# Altium project DS137-1.0-C二氧化硫传感器.PrjPcb
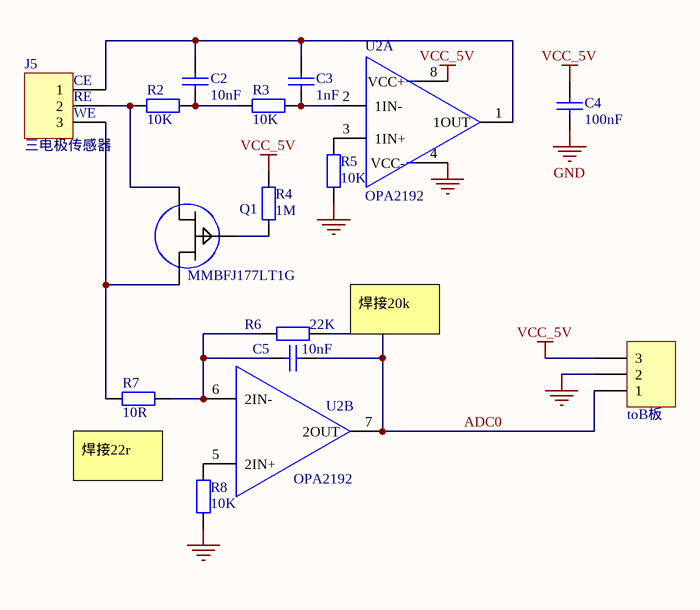
[diagram p0: DS137-1.0-C二氧化硫传感器.SchDoc]
2 sheets, 33 parts. Net scope: global (net labels, ports and power ports of the same name join across sheets).
Board file: DS137-1.0-C二氧化硫传感器.PcbDoc
Sheets:
  DS137-1.0-C二氧化硫传感器.SchDoc
  DS137-1.0-B二氧化硫传感器.SchDoc

## Sheet DS137-1.0-C二氧化硫传感器.SchDoc
size A4; SheetNumber: 1; SheetTotal: 2

### Parts
(Parts that share a designator on the sheet are numbered #1, #2 ... from top to bottom, then left to right.)
?  value toB板  [XH2.54-3P]  (hidden comment: SL000000028)
C2#1  value 10nF  [0603CAP]  (hidden comment: SMDCAP00010)
C3#1  value 1nF  [0603CAP]  (hidden comment: SMDCAP00008)
C4#1  value 100nF  [0603CAP]  (hidden comment: SMDCAP00013)
C5#1  value 10nF  [0603CAP]  (hidden comment: SMDCAP00010)
J5#1  value 三电极传感器  [3_Electrode]  (hidden comment: SL000000042)
Q1  MMBFJ177LT1G  [SOT23]
R2  value 10K  [0603RES]  (hidden comment: SMDRES00056)
R3  value 10K  [0603RES]  (hidden comment: SMDRES00056)
R4  value 1M  [0603RES]  (hidden comment: SMDRES00085)
R5  value 10K  [0603RES]  (hidden comment: SMDRES00056)
R6  value 22K  [0603RES]  (hidden comment: SMDRES00108)
R7  value 10R  [0603RES]  (hidden comment: SMDRES00005)
R8  value 10K  [0603RES]  (hidden comment: SMDRES00056)
U2#1  OPA2192  [SO-8]  (parts A,B of 2)

### Nets
GND: ?.2 C4#1.1 R5.1 R8.1 U2#1.4(VCC-)
VCC_5V: ?.3 C4#1.2 R4.2 U2#1.8(VCC+)
ADC0: ?.1 C5#1.1 R6.2 U2#1.7(2OUT)
NetC2#1_1: C2#1.1 R2.2 R3.1
NetC2#1_2: C2#1.2 C3#1.2 J5#1.1 U2#1.1(1OUT)
NetC3#1_1: C3#1.1 R3.2 U2#1.2(1IN-)
NetC5#1_2: C5#1.2 R6.1 R7.2 U2#1.6(2IN-)
NetJ5#1_2: J5#1.2 Q1.1(D) R2.1
NetJ5#1_3: J5#1.3 Q1.2(S) R7.1
NetQ1_3: Q1.3(G) R4.1
NetR5_2: R5.2 U2#1.3(1IN+)
NetR8_2: R8.2 U2#1.5(2IN+)

### Notes on the sheet
- (near J5#1) CE
- (near J5#1) RE
- (near J5#1) WE
- 焊接20k
- 焊接22r

### Library data of the parts
? = XH2.54mm-3A 直针座: 3P直针座
C2#1 C5#1 = MLCC 10nF 50V ±10％ 0603: 贴片电容
C3#1 = MLCC 1nF 50V ±10％ 0603: 贴片电容
C4#1 = MLCC 100nF 50V ±10％ 0603: 贴片电容
J5#1 = DIP3 单排直针 间距2.54mm 针长11mm 铜: 单排直针
Q1 = J177: P沟道JFET 结型场效应管(JFET) 适用于模拟开关和斩波器应用。
R2 R3 R5 R8 = Chip 10K 1/16W ±1％ 0603: 贴片电阻
R4 = Chip 1M 1/16W ±1％ 0603: 贴片电阻
R6 = Chip 22K 1/16W ±1％ 0603: 贴片电阻
R7 = Chip 10R 1/16W ±1％ 0603: 贴片电阻
U2#1 = TL062C

## Sheet DS137-1.0-B二氧化硫传感器.SchDoc
size A4; SheetNumber: 1; SheetTotal: 1
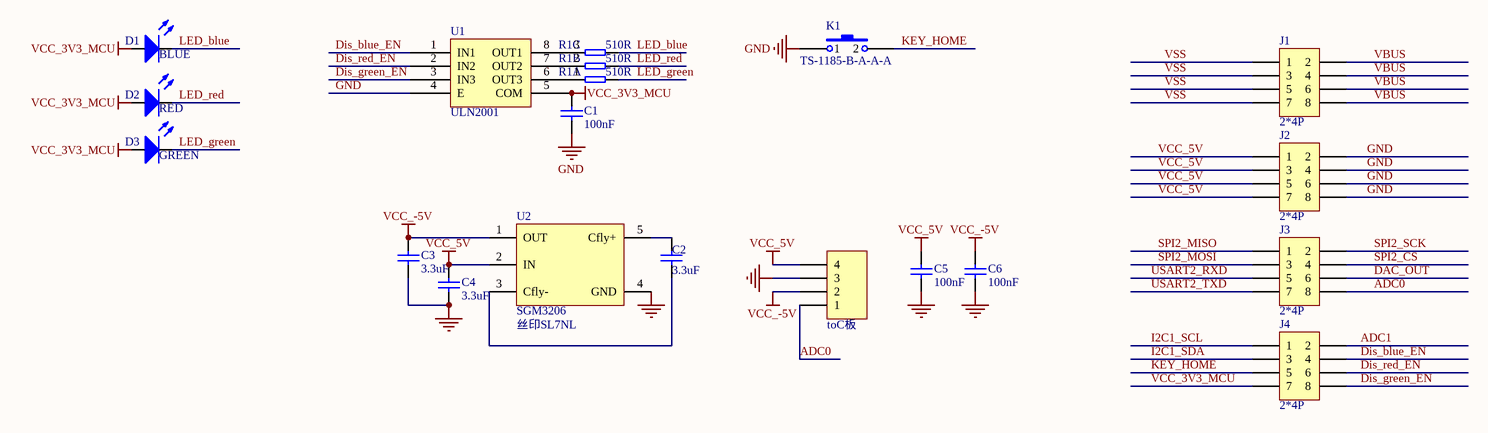
[diagram p1: DS137-1.0-B二氧化硫传感器.SchDoc]

### Parts
(Parts that share a designator on the sheet are numbered #1, #2 ... from top to bottom, then left to right.)
C1  value 100nF  [0603CAP]  (hidden comment: SMDCAP00013)
C2#2  value 3.3uF  [0603CAP]  (hidden comment: MLCC 3.3uF 50V ±10％ 0603)
C3#2  value 3.3uF  [0603CAP]
C4#2  value 3.3uF  [0603CAP]  (hidden comment: MLCC 3.3uF 50V ±10％ 0603)
C5#2  value 100nF  [0603CAP]  (hidden comment: SMDCAP00013)
C6  value 100nF  [0603CAP]  (hidden comment: SMDCAP00013)
D1  value BLUE  [LED_0805]  (hidden comment: SMDLED00010)
D2  value RED  [LED_0805]  (hidden comment: SMDLED00003)
D3  value GREEN  [LED_0805]  (hidden comment: Chip 翠绿LED 0805)
J1  value 2*4P  [X1321WVS-2x04J-C40D53]  (hidden comment: X1321WVS-2x04J-C40D53)
J2  value 2*4P  [X1321WVS-2x04J-C40D53]  (hidden comment: X1321WVS-2x04J-C40D53)
J3  value 2*4P  [X1321WVS-2x04J-C40D53]  (hidden comment: X1321WVS-2x04J-C40D53)
J4  value 2*4P  [X1321WVS-2x04J-C40D53]  (hidden comment: X1321WVS-2x04J-C40D53)
J5#2  value toC板  [XH2.54-4PW]  (hidden comment: SL000000034)
K1  TS-1185-B-A-A-A  [KEY_TS-1185-x-A-A-A]
R1  value 510R  [0603RES_Pack4]  (hidden comment: SMDRES05003)  (parts A,B,C of 4)
U1  value ULN2001  [SO-8]  (hidden comment: SMDIC000018)
U2#2  SGM3206  value 丝印SL7NL  [SOT23-5]

### Nets
GND: C1.1 C3#2.2 C4#2.2 C5#2.1 C6.1 J2.2 J2.4 J2.6 J2.8 J5#2.3 K1.1 U1.4(E) U2#2.4(GND)
VCC_3V3_MCU: C1.2 D1.1(A) D2.1(A) D3.1(A) J4.7 U1.5(COM)
VCC_5V: C4#2.1 C5#2.2 J2.1 J2.3 J2.5 J2.7 J5#2.4 U2#2.2(IN)
VCC_-5V: C3#2.1 C6.2 J5#2.2 U2#2.1(OUT)
ADC0: J3.8 J5#2.1
ADC1: J4.2
DAC_OUT: J3.6
Dis_blue_EN: J4.4 U1.1(IN1)
Dis_green_EN: J4.8 U1.3(IN3)
Dis_red_EN: J4.6 U1.2(IN2)
I2C1_SCL: J4.1
I2C1_SDA: J4.3
KEY_HOME: J4.5 K1.2
LED_blue: D1.2(K) R1.6
LED_green: D3.2(K) R1.8
LED_red: D2.2(K) R1.7
SPI2_CS: J3.4
SPI2_MISO: J3.1
SPI2_MOSI: J3.3
SPI2_SCK: J3.2
USART2_RXD: J3.5
USART2_TXD: J3.7
VBUS: J1.2 J1.4 J1.6 J1.8
VSS: J1.1 J1.3 J1.5 J1.7
NetC2#2_1: C2#2.1 U2#2.3(Cfly-)
NetC2#2_2: C2#2.2 U2#2.5(Cfly+)
NetR1_1: R1.1 U1.6(OUT3)
NetR1_2: R1.2 U1.7(OUT2)
NetR1_3: R1.3 U1.8(OUT1)

### Library data of the parts
C1 C5#2 C6 = MLCC 100nF 50V ±10％ 0603: 贴片电容
C2#2 C3#2 C4#2 = MLCC 3.3uF 50V ±10％ 0603: 贴片电容
D1 = Chip 蓝色LED 0805: 贴片LED
D2 = Chip 红色LED 0805: 贴片LED
D3 = Chip 翠绿LED 0805: 贴片LED
J1-J4 = X1321WVS-2x04J-C40D53: 双排针2x4P 立贴 1.27mm
J5#2 = XH2.54mm-4AW 弯针座: 4P弯针座
K1 = TS-1185-B-A-A-A: 轻触开关; Value: TS-1185-B-A-A-A
R1 = Chip R*4 510R 1/16W ±5％ 0603: 贴片排阻
U1 = ULN2001 SOP-8: 电机驱动芯片
U2#2 = SGM3206: 电荷泵芯片

## Nets that join several sheets
GND: DS137-1.0-C二氧化硫传感器 (5 pins), DS137-1.0-B二氧化硫传感器 (13 pins)
VCC_5V: DS137-1.0-C二氧化硫传感器 (?.3 C4#1.2 R4.2 U2#1.8), DS137-1.0-B二氧化硫传感器 (8 pins)
ADC0: DS137-1.0-C二氧化硫传感器 (?.1 C5#1.1 R6.2 U2#1.7), DS137-1.0-B二氧化硫传感器 (J3.8 J5#2.1)